# EAGLE schematic main (EAGLE 7.2.0)
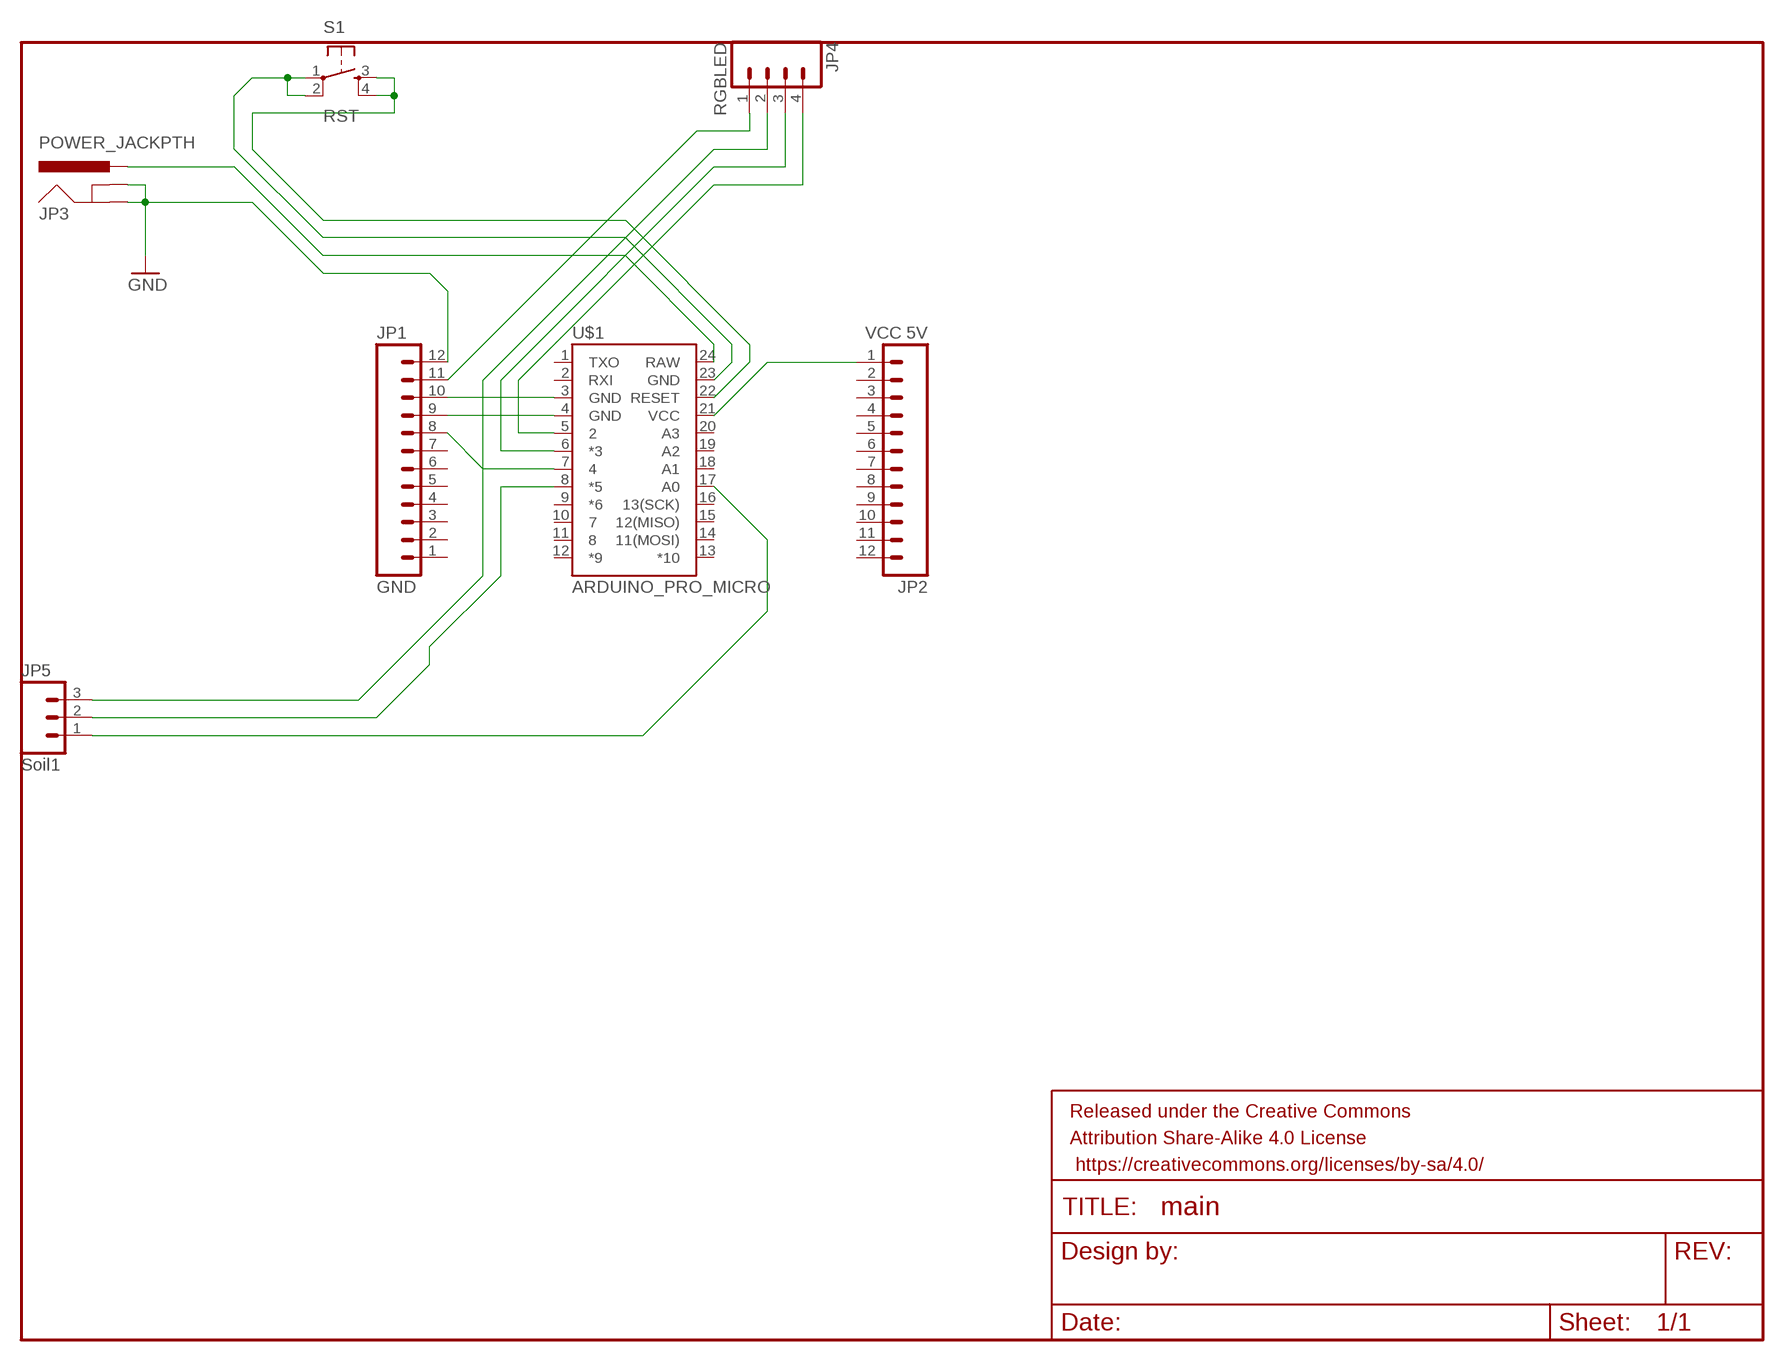
[diagram p0: schematic, sheet 1]

## Parts
JP1  GND  M12LONGPADS  [1X12_LONGPADS]
JP2  VCC 5V  M12LONGPADS  [1X12_LONGPADS]
JP3  POWER_JACKPTH  [POWER_JACK_PTH]
JP4  RGBLED  M04JST-PTH-VERT  [JST-4-PTH-VERT]
JP5  Soil1  M03JST-PTH  [JST-3-PTH]
MAIN_PCB_FRAME  Main frame PCB  FRAME-LETTERNO_PACKAGE  [DUMMY]
S1  RST  TAC_SWITCHPTH  [TACTILE-PTH]
U$1  ARDUINO_PRO_MICRO  [ARDUINO_PRO_MICRO]

## Nets
GND: JP1.12 JP3.GND JP3.GNDBREAK
N$1: JP2.1 U$1.21(VCC)
N$2: JP4.4 U$1.5
N$3: S1.1 S1.2 U$1.23(GND)
N$4: JP3.PWR U$1.24(RAW)
N$5: JP1.10 U$1.3(GND)
N$6: S1.3 S1.4 U$1.22(RESET)
N$7: JP1.9 U$1.4(GND)
N$8: JP4.3 U$1.6(*3)
N$9: JP4.2 U$1.7
N$10: JP1.11 JP4.1
N$11: JP1.8 JP5.3
N$12: JP5.2 U$1.8(*5)
N$13: JP5.1 U$1.17(A0)
Unconnected: JP1.1 JP1.2 JP1.3 JP1.4 JP1.5 JP1.6 JP1.7 JP2.2 JP2.3 JP2.4 JP2.5 JP2.6 JP2.7 JP2.8 JP2.9 JP2.10 JP2.11 JP2.12 U$1.1(TXO) U$1.2(RXI) U$1.9(*6) U$1.10 U$1.11 U$1.12(*9) U$1.13(*10) U$1.14(11(MOSI)) U$1.15(12(MISO)) U$1.16(13(SCK)) U$1.18(A1) U$1.19(A2) U$1.20(A3)

## Library data of the parts
JP1 JP2 = SparkFun-Connectors:M12: Header 12 Standard 12-pin 0.1" header. Use with straight break away headers (SKU : PRT-00116), right angle break away headers (PRT-00553), swiss pins (PRT-00743), machine pins (PRT-00117), and female headers (PRT-00115).
JP3 = SparkFun-Connectors:POWER_JACK: Power Jack This is the standard 5.5mm barrel jack for power. The PTH is the most common, proven, reliable, footprint. The Slot footprint only works if the mill layer is transmitted to the PCB fab house so be warned. Mating wall wart : TOL-00298 (and others); PROD_ID: CONN-08197
JP4 = SparkFun-Connectors:M04: Header 4 Standard 4-pin 0.1" header. Use with straight break away headers (SKU : PRT-00116), right angle break away headers (PRT-00553), swiss pins (PRT-00743), machine pins (PRT-00117), and female headers (PRT-00115). Molex polarized connector foot print use with SKU : PRT-08231 with associated crimp pins and housings. 1MM SMD Version SKU: PRT-10208
JP5 = SparkFun-Connectors:M03: Header 3 Standard 3-pin 0.1" header. Use with straight break away headers (SKU : PRT-00116), right angle break away headers (PRT-00553), swiss pins (PRT-00743), machine pins (PRT-00117), and female headers (PRT-00115). Molex polarized connector foot print use with SKU : PRT-08232 with associated crimp pins and housings.; SKU: PRT-09915
MAIN_PCB_FRAME = SparkFun-Aesthetics:FRAME-LETTER: Schematic Frame Standard 8.5x11 US Letter frame; DESIGNER: Kent; VERSION: v 0.1
S1 = SparkFun-Retired:TAC_SWITCH: Momentary Switch Button commonly used for reset or general input. Spark Fun Electronics SKU : COM-00097 SMT- SWCH-08247
U$1 = SparkFun-Boards:ARDUINO_PRO_MICRO